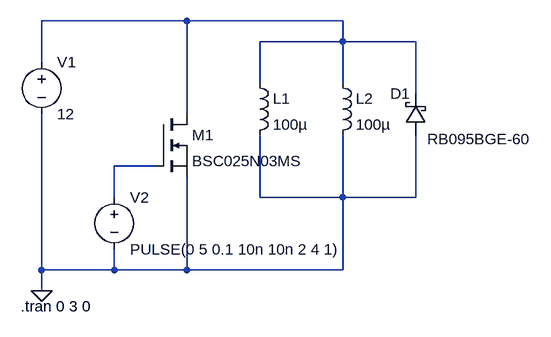
[diagram p0: schematic ltspice file of the Solenoid Lock Circuit .asc]
ltspice file of the Solenoid Lock Circuit .asc, the LTspice schematic file:
Version 4
SHEET 1 880 680
WIRE 208 -48 -16 -48
WIRE 448 -48 208 -48
WIRE 448 -16 448 -48
WIRE 448 -16 320 -16
WIRE 560 -16 448 -16
WIRE -16 16 -16 -48
WIRE 320 48 320 -16
WIRE 448 48 448 -16
WIRE 560 64 560 -16
WIRE 208 96 208 -48
WIRE 160 176 96 176
WIRE 96 224 96 176
WIRE 320 224 320 128
WIRE 448 224 448 128
WIRE 448 224 320 224
WIRE 560 224 560 128
WIRE 560 224 448 224
WIRE -16 336 -16 96
WIRE 96 336 96 304
WIRE 96 336 -16 336
WIRE 208 336 208 192
WIRE 208 336 96 336
WIRE 448 336 448 224
WIRE 448 336 208 336
WIRE -16 368 -16 336
FLAG -16 368 0
SYMBOL voltage -16 0 R0
WINDOW 123 0 0 Left 0
WINDOW 39 0 0 Left 0
SYMATTR InstName V1
SYMATTR Value 12
SYMBOL nmos 160 96 R0
SYMATTR InstName M1
SYMATTR Value BSC025N03MS
SYMBOL ind 304 32 R0
SYMATTR InstName L1
SYMATTR Value 100µ
SYMATTR SpiceLine Ipk=0.6 Rser=20
SYMBOL ind 432 32 R0
SYMATTR InstName L2
SYMATTR Value 100µ
SYMATTR SpiceLine Ipk=0.6 Rser=20
SYMBOL voltage 96 208 R0
WINDOW 123 0 0 Left 0
WINDOW 39 0 0 Left 0
SYMATTR InstName V2
SYMATTR Value PULSE(0 5 0.1 10n 10n 2 4 1)
SYMBOL schottky 576 128 R180
WINDOW 0 24 64 Left 2
WINDOW 3 -161 -6 Left 2
SYMATTR InstName D1
SYMATTR Value RB095BGE-60
SYMATTR Description Diode
SYMATTR Type diode
TEXT -48 392 Left 2 !.tran 0 3 0

The netlist it stands for:
* ltspice file of the Solenoid Lock Circuit .asc
V1 N001 0 12
M1 N001 N002 0 0 BSC025N03MS
L1 N001 0 100µ Ipk=0.6 Rser=20
L2 N001 0 100µ Ipk=0.6 Rser=20
V2 N002 0 PULSE(0 5 0.1 10n 10n 2 4 1)
D1 0 N001 RB095BGE-60
.model D D
.lib standard.dio
.model NMOS NMOS
.model PMOS PMOS
.lib standard.mos
.tran 0 3 0
.backanno
.end